# EAGLE schematic noisa (EAGLE 7.2.0)
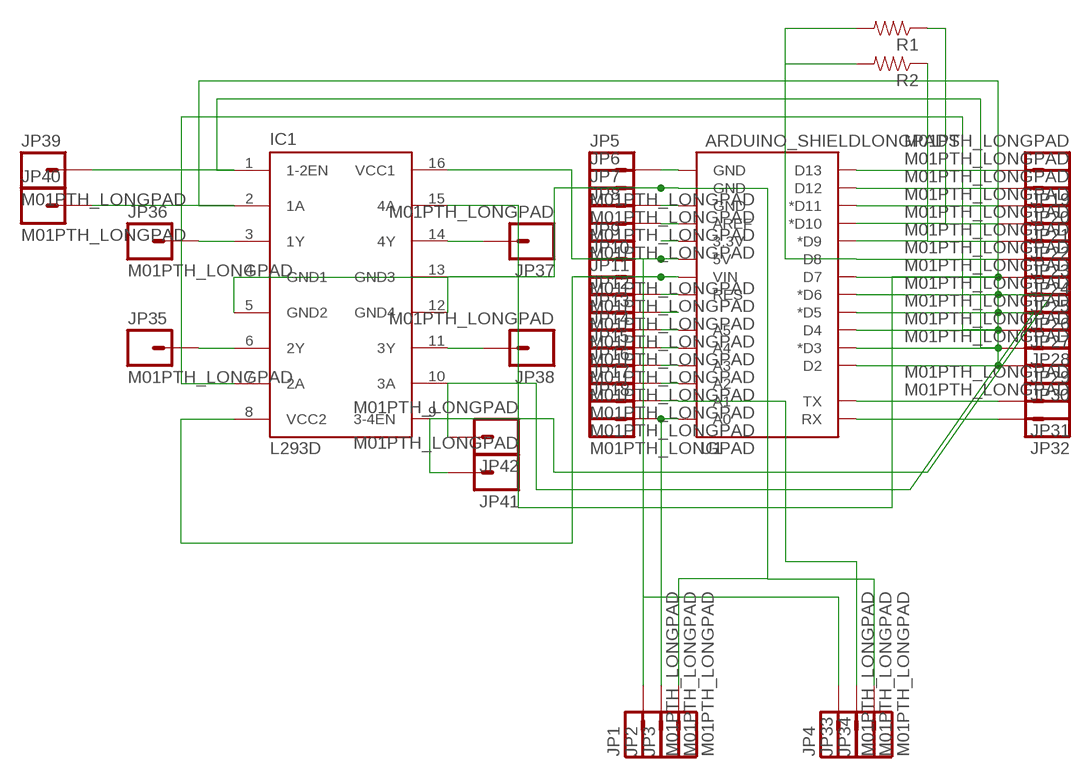
[diagram p0: schematic, sheet 1]

## Parts
IC1  L293D  [DIL16]
JP1  M01PTH_LONGPAD  [1X01_LONGPAD]
JP2  M01PTH_LONGPAD  [1X01_LONGPAD]
JP3  M01PTH_LONGPAD  [1X01_LONGPAD]
JP4  M01PTH_LONGPAD  [1X01_LONGPAD]
JP5  M01PTH_LONGPAD  [1X01_LONGPAD]
JP6  M01PTH_LONGPAD  [1X01_LONGPAD]
JP7  M01PTH_LONGPAD  [1X01_LONGPAD]
JP8  M01PTH_LONGPAD  [1X01_LONGPAD]
JP9  M01PTH_LONGPAD  [1X01_LONGPAD]
JP10  M01PTH_LONGPAD  [1X01_LONGPAD]
JP11  M01PTH_LONGPAD  [1X01_LONGPAD]
JP12  M01PTH_LONGPAD  [1X01_LONGPAD]
JP13  M01PTH_LONGPAD  [1X01_LONGPAD]
JP14  M01PTH_LONGPAD  [1X01_LONGPAD]
JP15  M01PTH_LONGPAD  [1X01_LONGPAD]
JP16  M01PTH_LONGPAD  [1X01_LONGPAD]
JP17  M01PTH_LONGPAD  [1X01_LONGPAD]
JP18  M01PTH_LONGPAD  [1X01_LONGPAD]
JP19  M01PTH_LONGPAD  [1X01_LONGPAD]
JP20  M01PTH_LONGPAD  [1X01_LONGPAD]
JP21  M01PTH_LONGPAD  [1X01_LONGPAD]
JP22  M01PTH_LONGPAD  [1X01_LONGPAD]
JP23  M01PTH_LONGPAD  [1X01_LONGPAD]
JP24  M01PTH_LONGPAD  [1X01_LONGPAD]
JP25  M01PTH_LONGPAD  [1X01_LONGPAD]
JP26  M01PTH_LONGPAD  [1X01_LONGPAD]
JP27  M01PTH_LONGPAD  [1X01_LONGPAD]
JP28  M01PTH_LONGPAD  [1X01_LONGPAD]
JP29  M01PTH_LONGPAD  [1X01_LONGPAD]
JP30  M01PTH_LONGPAD  [1X01_LONGPAD]
JP31  M01PTH_LONGPAD  [1X01_LONGPAD]
JP32  M01PTH_LONGPAD  [1X01_LONGPAD]
JP33  M01PTH_LONGPAD  [1X01_LONGPAD]
JP34  M01PTH_LONGPAD  [1X01_LONGPAD]
JP35  M01PTH_LONGPAD  [1X01_LONGPAD]
JP36  M01PTH_LONGPAD  [1X01_LONGPAD]
JP37  M01PTH_LONGPAD  [1X01_LONGPAD]
JP38  M01PTH_LONGPAD  [1X01_LONGPAD]
JP39  M01PTH_LONGPAD  [1X01_LONGPAD]
JP40  M01PTH_LONGPAD  [1X01_LONGPAD]
JP41  M01PTH_LONGPAD  [1X01_LONGPAD]
JP42  M01PTH_LONGPAD  [1X01_LONGPAD]
R1  RESISTORKIT  [AXIAL-0.3-KIT]
R2  RESISTORKIT  [AXIAL-0.3-KIT]
U1  ARDUINO_SHIELDLONGPADS  [DUEMILANOVE_SHIELD_LONGPADS]

## Nets
N$1: JP5.1 U1.GND@0(GND)
N$2: IC1.8(VCC2) JP10.1 U1.VIN
N$3: IC1.16(VCC1) JP1.1 JP4.1 JP9.1 U1.5V
N$4: IC1.1(1-2EN) JP29.1 JP39.1 U1.D3(*D3)
N$5: IC1.7(2A) JP28.1 U1.D4
N$6: IC1.2(1A) JP30.1 JP40.1 U1.D2
N$7: IC1.9(3-4EN) JP26.1 JP41.1 U1.D6(*D6)
N$8: IC1.10(3A) JP27.1 JP42.1 U1.D5(*D5)
N$9: IC1.15(4A) JP25.1 U1.D7
N$10: IC1.3(1Y) JP36.1
N$11: IC1.6(2Y) JP35.1
N$12: IC1.14(4Y) JP37.1
N$13: IC1.11(3Y) JP38.1
N$14: JP2.1 JP18.1 U1.A0
N$15: JP17.1 JP33.1 U1.A1
N$16: IC1.4(GND1) IC1.5(GND2) IC1.12(GND4) IC1.13(GND3) JP3.1 JP6.1 JP34.1 U1.GND@1(GND)
N$17: JP7.1 U1.GND@2(GND)
N$18: JP8.1 U1.AREF
N$19: U1.3.3V
N$20: JP11.1 U1.RES
N$21: JP12.1
N$22: JP13.1 U1.A5
N$23: JP14.1 U1.A4
N$24: JP15.1 U1.A3
N$25: JP16.1 U1.A2
N$26: JP19.1 U1.D13
N$27: JP20.1 U1.D12
N$28: JP21.1 U1.D11(*D11)
N$29: JP22.1 R1.P$1 U1.D10(*D10)
N$30: JP23.1 R2.P$1 U1.D9(*D9)
N$31: JP24.1 R1.P$2 R2.P$2 U1.D8
N$32: JP31.1 U1.TX
N$33: JP32.1 U1.RX

## Library data of the parts
IC1 = st-microelectronics:L293D: PUSH-PULL 4 CHANNEL DRIVER; MPN: L293D; OC_FARNELL: 9589619; OC_NEWARK: 56P8249
JP1-JP42 = SparkFun-Connectors:M01: Header 1 Standard 1-pin 0.1" header. Use with straight break away headers (SKU : PRT-00116), right angle break away headers (PRT-00553), swiss pins (PRT-00743), machine pins (PRT-00117), and female headers (PRT-00115).
R1 R2 = SparkFun-Passives:RESISTOR: Resistor Basic schematic elements and footprints for 0603, 1206, and PTH resistors.
U1 = SparkFun-Boards:ARDUINO_SHIELD: Arduino shield footprint